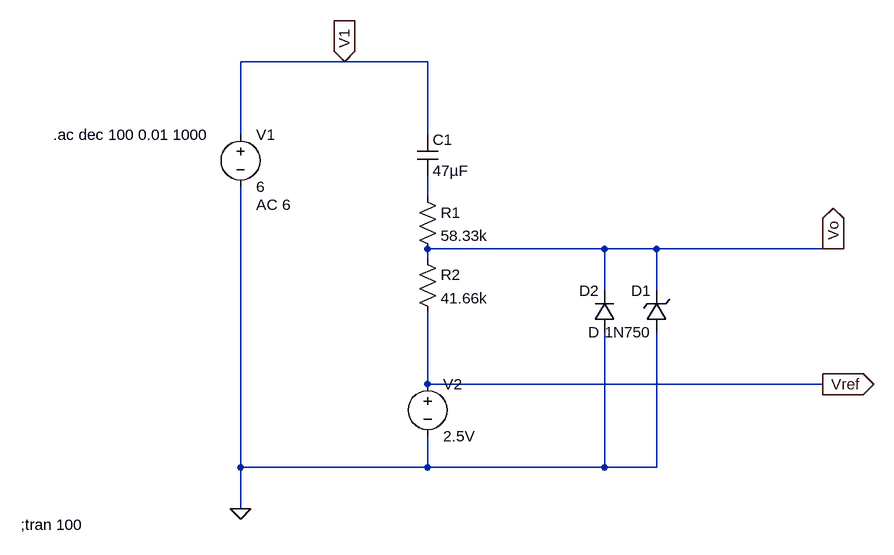
[diagram p0: schematic shift_decoupling_vref.asc]
shift_decoupling_vref.asc, the LTspice schematic file:
Version 4
SHEET 1 1024 680
WIRE 176 -48 16 -48
WIRE 304 -48 176 -48
WIRE 16 64 16 -48
WIRE 304 64 304 -48
WIRE 304 160 304 128
WIRE 576 240 304 240
WIRE 656 240 576 240
WIRE 928 240 656 240
WIRE 944 240 928 240
WIRE 304 256 304 240
WIRE 576 304 576 240
WIRE 656 304 656 240
WIRE 304 448 304 336
WIRE 912 448 304 448
WIRE 16 576 16 144
WIRE 304 576 304 528
WIRE 304 576 16 576
WIRE 576 576 576 368
WIRE 576 576 304 576
WIRE 656 576 656 368
WIRE 656 576 576 576
WIRE 16 640 16 576
FLAG 16 640 0
FLAG 928 240 Vo
IOPIN 928 240 Out
FLAG 176 -48 V1
IOPIN 176 -48 In
FLAG 912 448 Vref
IOPIN 912 448 Out
SYMBOL cap 288 64 R0
SYMATTR InstName C1
SYMATTR Value 47µF
SYMBOL res 288 144 R0
SYMATTR InstName R1
SYMATTR Value 58.33k
SYMBOL res 288 240 R0
SYMATTR InstName R2
SYMATTR Value 41.66k
SYMBOL voltage 16 48 R0
WINDOW 123 24 124 Left 2
WINDOW 39 0 0 Left 2
SYMATTR Value2 AC 6
SYMATTR InstName V1
SYMATTR Value 6
SYMBOL voltage 304 432 R0
SYMATTR InstName V2
SYMATTR Value 2.5V
SYMBOL diode 592 368 R180
WINDOW 0 24 64 Left 2
WINDOW 3 24 0 Left 2
SYMATTR InstName D2
SYMBOL zener 672 368 R180
WINDOW 0 24 64 Left 2
WINDOW 3 24 0 Left 2
SYMATTR InstName D1
SYMATTR Value 1N750
TEXT -322 664 Left 2 !;tran 100
TEXT -272 64 Left 2 !.ac dec 100 0.01 1000

The netlist it stands for:
* shift_decoupling_vref.asc
C1 V1 N001 47µF
R1 N001 Vo 58.33k
R2 Vo Vref 41.66k
V1 V1 0 6 AC 6
V2 Vref 0 2.5V
D2 0 Vo D
D1 0 Vo 1N750
.model D D
.lib standard.dio
;tran 100
.ac dec 100 0.01 1000
.backanno
.end